# Altium schematic sheet TK540_Frontpanel.SchDoc: TK540 Frontpanel
size A3; Organization: Omega Verksted; DocumentNumber: 20; Revision: 0; SheetNumber: 20; SheetTotal: 20
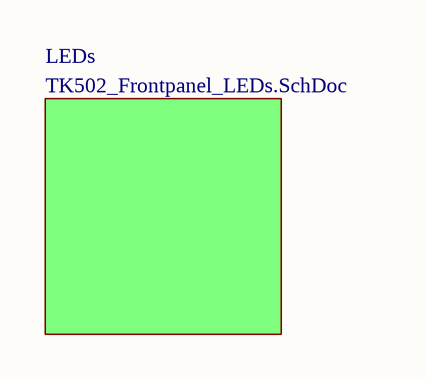
[diagram p0: TK540_Frontpanel.SchDoc]

## Sub-sheets
LEDs = TK502_Frontpanel_LEDs.SchDoc: no entries

## Notes on the sheet
- Size:
- Date:
- Title:
- A3
- Revision:
- Sheet
- of
- Author:
- File: